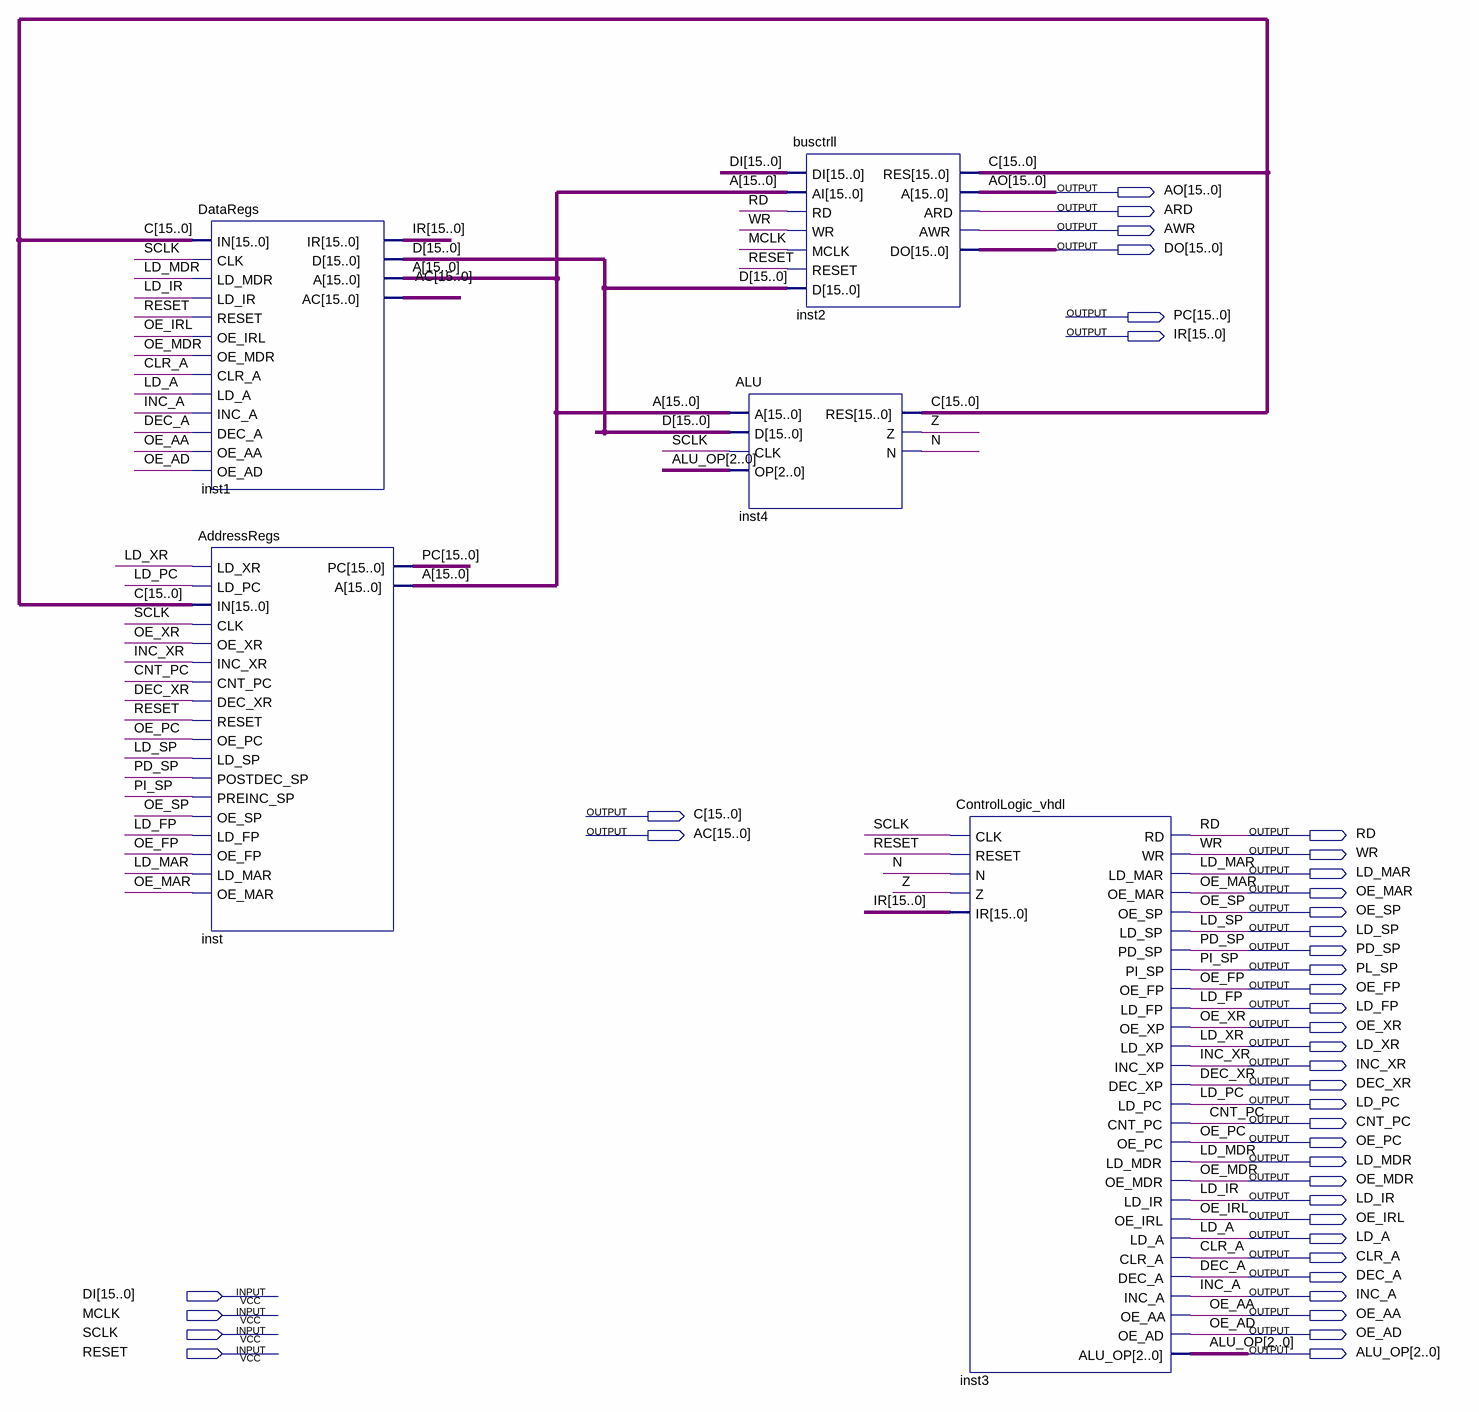
[diagram p0: schematic sheet]
// Quartus schematic StackMachine.bdf as structural Verilog: 5 symbols, 40 pins
module StackMachine (
  input  [15:0] DI,
  input  MCLK,
  input  SCLK,
  input  RESET,
  output [15:0] AO,
  output ARD,
  output AWR,
  output [15:0] DO,
  output [15:0] PC,
  output [15:0] IR,
  output [15:0] C,
  output [15:0] AC,
  output RD,
  output WR,
  output LD_MAR,
  output OE_MAR,
  output OE_SP,
  output LD_SP,
  output PD_SP,
  output PL_SP,
  output OE_FP,
  output LD_FP,
  output OE_XR,
  output LD_XR,
  output INC_XR,
  output DEC_XR,
  output LD_PC,
  output CNT_PC,
  output OE_PC,
  output LD_MDR,
  output OE_MDR,
  output LD_IR,
  output OE_IRL,
  output LD_A,
  output CLR_A,
  output DEC_A,
  output INC_A,
  output OE_AA,
  output OE_AD,
  output [2:0] ALU_OP
);

  wire N, Z;
  wire [15:0] A, D;

  DataRegs inst1 (
    .IN(C), .CLK(SCLK), .LD_MDR(LD_MDR), .LD_IR(LD_IR), .RESET(RESET), .OE_IRL(OE_IRL), .OE_MDR(OE_MDR),
    .CLR_A(CLR_A), .LD_A(LD_A), .INC_A(INC_A), .DEC_A(DEC_A), .OE_AA(OE_AA), .OE_AD(OE_AD), .IR(IR), .D(D),
    .A(A), .AC(AC));
  AddressRegs inst (
    .LD_XR(LD_XR), .LD_PC(LD_PC), .IN(C), .CLK(SCLK), .OE_XR(OE_XR), .INC_XR(INC_XR), .CNT_PC(CNT_PC),
    .DEC_XR(DEC_XR), .RESET(RESET), .OE_PC(OE_PC), .LD_SP(LD_SP), .POSTDEC_SP(PD_SP), .PREINC_SP(PL_SP),
    .OE_SP(OE_SP), .LD_FP(LD_FP), .OE_FP(OE_FP), .LD_MAR(LD_MAR), .OE_MAR(OE_MAR), .PC(PC), .A(A));
  busctrll inst2 (
    .DI(DI), .AI(A), .RD(RD), .WR(WR), .MCLK(MCLK), .RESET(RESET), .D(D), .RES(C), .A(AO), .ARD(ARD),
    .AWR(AWR), .DO(DO));
  ALU inst4 (.A(A), .D(D), .CLK(SCLK), .OP(ALU_OP), .RES(C), .Z(Z), .N(N));
  ControlLogic_vhdl inst3 (
    .CLK(SCLK), .RESET(RESET), .N(N), .Z(Z), .IR(IR), .RD(RD), .WR(WR), .LD_MAR(LD_MAR), .OE_MAR(OE_MAR),
    .OE_SP(OE_SP), .LD_SP(LD_SP), .PD_SP(PD_SP), .PI_SP(PL_SP), .OE_FP(OE_FP), .LD_FP(LD_FP), .OE_XP(OE_XR),
    .LD_XP(LD_XR), .INC_XP(INC_XR), .DEC_XP(DEC_XR), .LD_PC(LD_PC), .CNT_PC(CNT_PC), .OE_PC(OE_PC),
    .LD_MDR(LD_MDR), .OE_MDR(OE_MDR), .LD_IR(LD_IR), .OE_IRL(OE_IRL), .LD_A(LD_A), .CLR_A(CLR_A),
    .DEC_A(DEC_A), .INC_A(INC_A), .OE_AA(OE_AA), .OE_AD(OE_AD), .ALU_OP(ALU_OP));

  // Other names for the same wires on the sheet: PI_SP = PL_SP
endmodule
